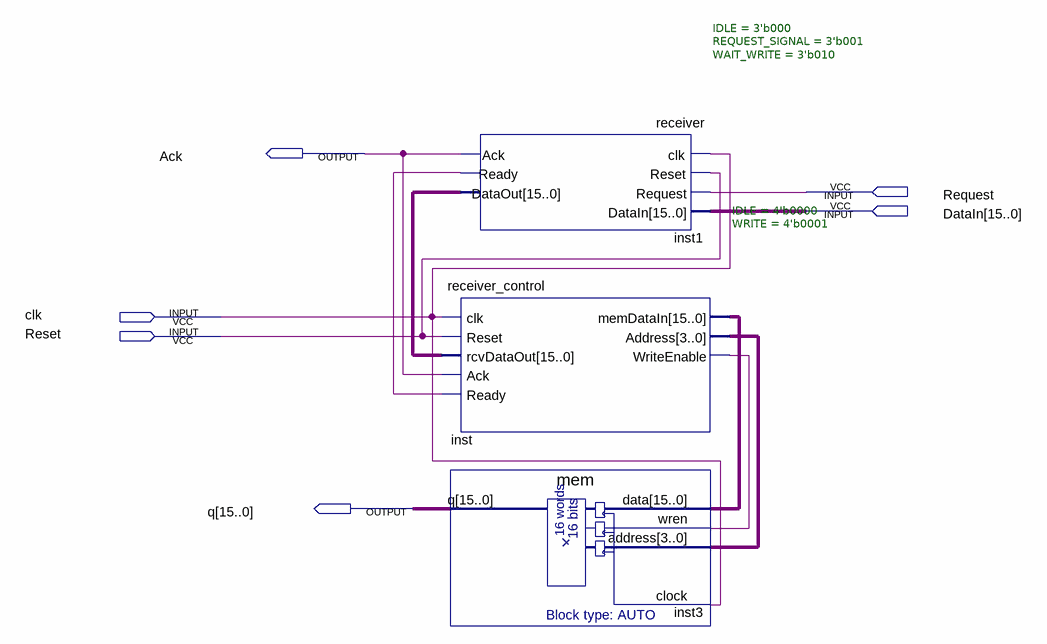
[diagram p0: schematic sheet]
// Quartus schematic receiver_ic.bdf as structural Verilog: 3 symbols, 6 pins
module receiver_ic (
  input  Request,
  input  [15:0] DataIn,
  input  clk,
  input  Reset,
  output Ack,
  output [15:0] q
);

  wire inst1_ready, inst_writeenable;
  wire [3:0] inst_address;
  wire [15:0] inst1_dataout, inst_memdatain;

  receiver_control #(.IDLE(4'b0000), .WRITE(4'b0001)) inst (
    .clk(clk), .Reset(Reset), .rcvDataOut(inst1_dataout), .Ack(Ack), .Ready(inst1_ready),
    .memDataIn(inst_memdatain), .Address(inst_address), .WriteEnable(inst_writeenable));
  mem inst3 (.data(inst_memdatain), .wren(inst_writeenable), .address(inst_address), .clock(clk), .q(q));
  receiver #(.IDLE(3'b000), .REQUEST_SIGNAL(3'b001), .WAIT_WRITE(3'b010)) inst1 (
    .clk(clk), .Reset(Reset), .Request(Request), .DataIn(DataIn), .Ack(Ack), .Ready(inst1_ready),
    .DataOut(inst1_dataout));
endmodule
